# EAGLE design amplifier (EAGLE 9.6.2)
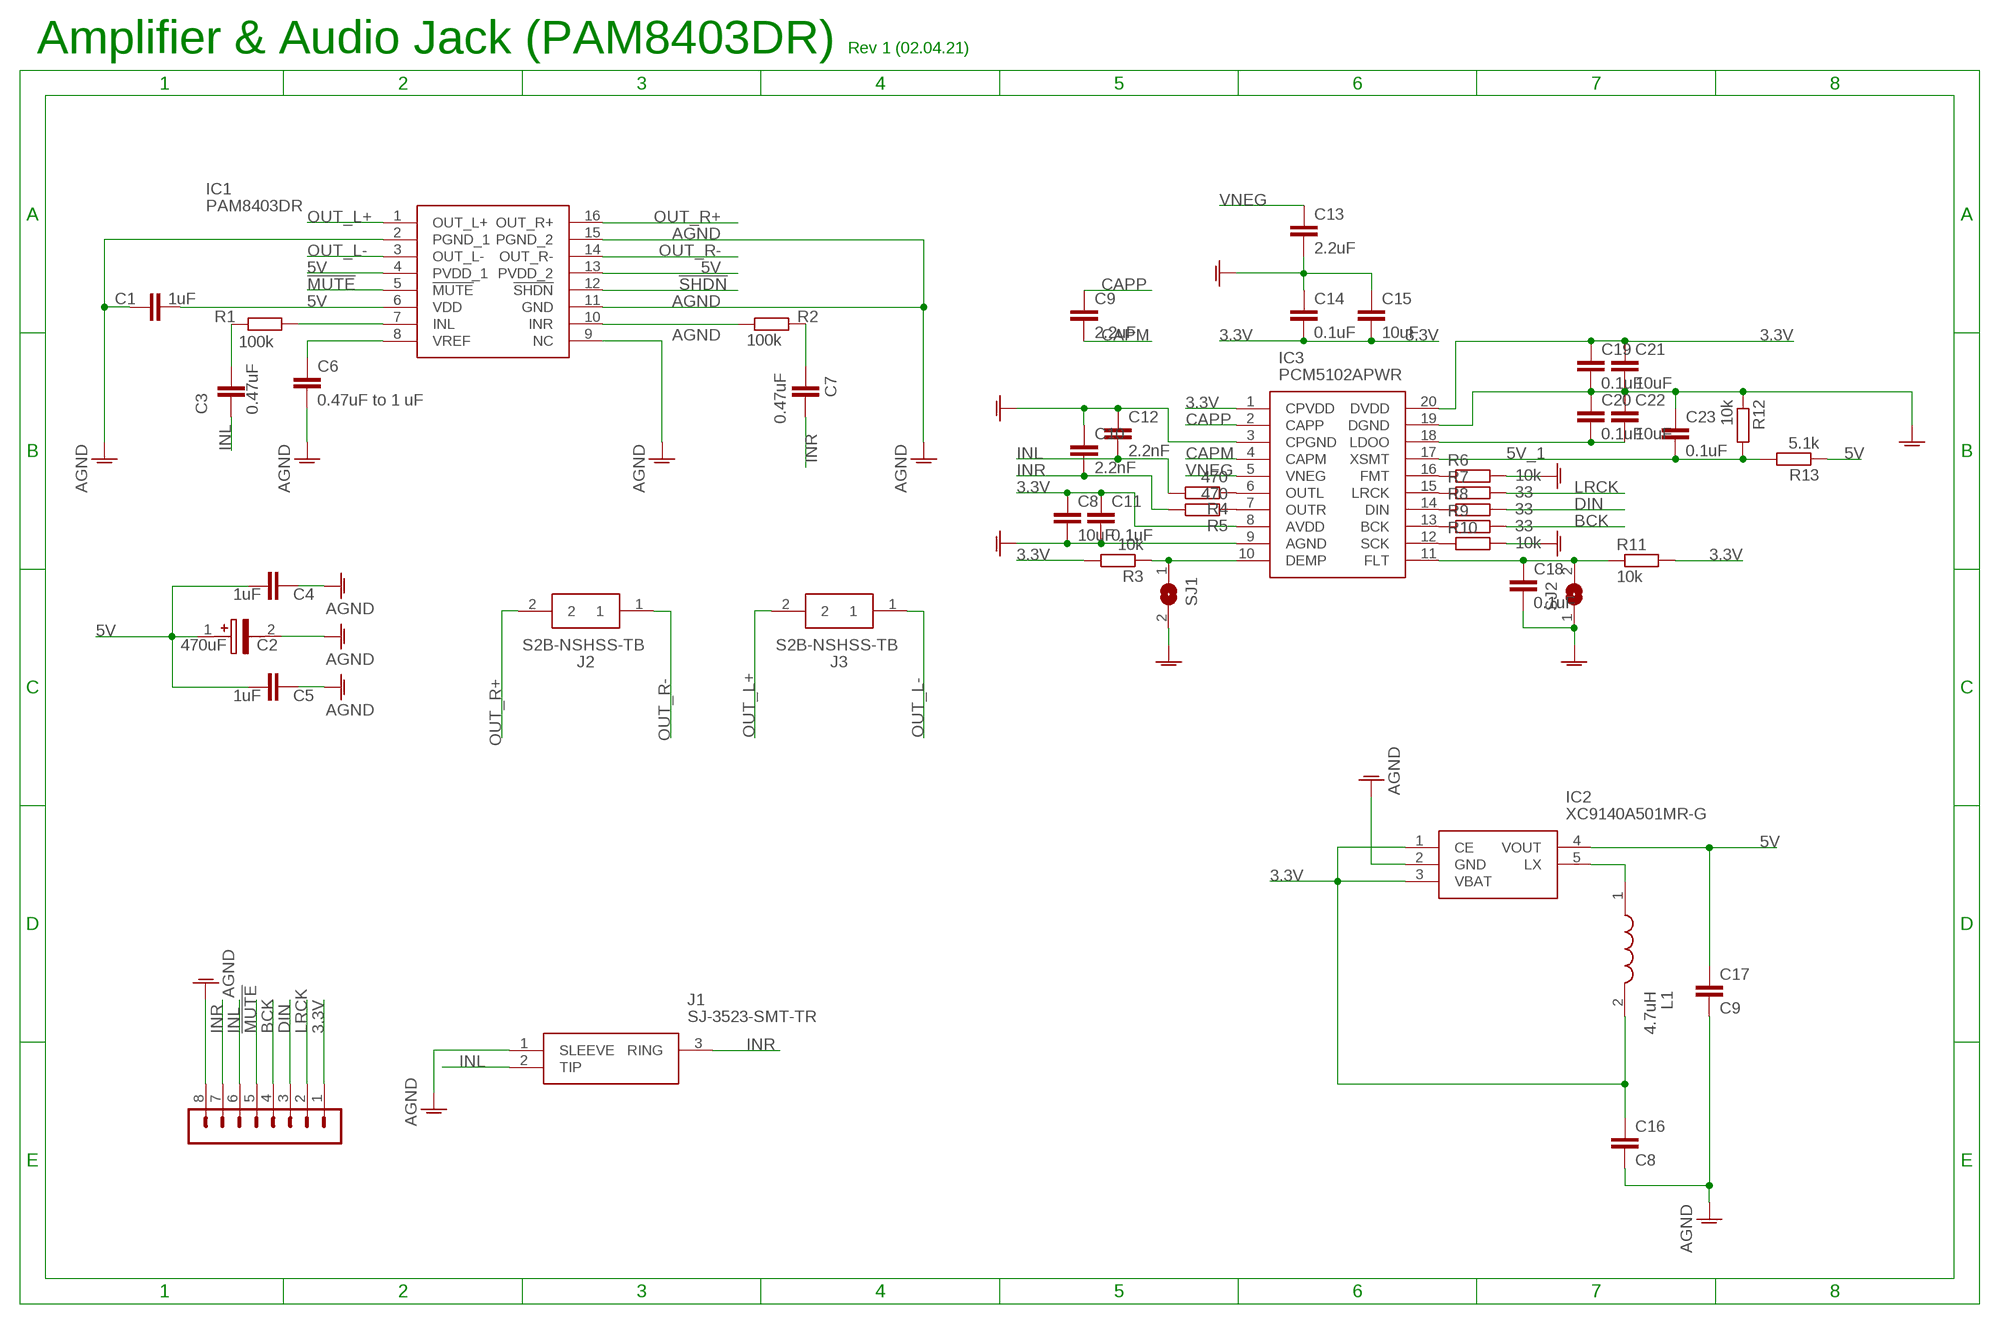
[diagram p0: schematic, sheet 1]

## Parts
C1  1uF  C-EU_805C0805  [C0805]
C2  470uF  293D477X9010E2TE3  [CAPPM7343X430N]
C3  0.47uF  C-EU_805C0805  [C0805]
C4  1uF  C-EU_805C0805  [C0805]
C5  1uF  C-EU_805C0805  [C0805]
C6  0.47uF to 1 uF  C-EU_805C0805  [C0805]
C7  0.47uF  C-EU_805C0805  [C0805]
C8  10uF  C-EUC0603  [C0603]
C9  2.2uF  C-EUC0603  [C0603]
C10  2.2nF  C-EUC0603  [C0603]
C11  0.1uF  C-EUC0603  [C0603]
C12  2.2nF  C-EUC0603  [C0603]
C13  2.2uF  C-EUC0603  [C0603]
C14  0.1uF  C-EUC0603  [C0603]
C15  10uF  C-EUC0603  [C0603]
C16  C8  C-EUC1206K  [C1206K]
C17  C9  C-EUC1206K  [C1206K]
C18  0.1uF  C-EUC0603K  [C0603K]
C19  0.1uF  C-EUC0603K  [C0603K]
C20  0.1uF  C-EUC0603K  [C0603K]
C21  10uF  C-EUC0603K  [C0603K]
C22  10uF  C-EUC0603K  [C0603K]
C23  0.1uF  C-EUC0603K  [C0603K]
IC1  PAM8403DR  [SOIC127P605X175-16N]
IC2  XC9140A501MR-G  [SOT95P280X130-5N]
IC3  PCM5102APWR  [SOP65P640X120-20N]
J1  SJ-3523-SMT-TR  [SJ3523SMTTR]
J2  S2B-NSHSS-TB  [SM02B-NSHSS-TB]
J3  S2B-NSHSS-TB  [SM02B-NSHSS-TB]
JP1  PINHEADER-1X8  [MA08-1]
L1  4.7uH  VLS6045EX-221M  [INDPM6060X450N]
R1  100k  R-EU_805R0805  [R0805]
R2  100k  R-EU_805R0805  [R0805]
R3  10k  R-EU_R0603  [R0603]
R4  470  R-EU_R0603  [R0603]
R5  470  R-EU_R0603  [R0603]
R6  10k  R-EU_R0603  [R0603]
R7  33  R-EU_R0603  [R0603]
R8  33  R-EU_R0603  [R0603]
R9  33  R-EU_R0603  [R0603]
R10  10k  R-EU_R0603  [R0603]
R11  10k  R-EU_R0603  [R0603]
R12  10k  R-EU_R0603  [R0603]
R13  5.1k  R-EU_R0603  [R0603]
SJ1  SJ  [SJ]
SJ2  SJ  [SJ]

## Nets
3.3V: C8.1 C11.1 C14.2 C15.2 C16.1 C19.1 C21.1 IC2.1(CE) IC2.3(VBAT) IC3.1(CPVDD) IC3.8(AVDD) IC3.20(DVDD) JP1.1 L1.2 R3.2 R11.2
5V: C1.1 C2.1(+) C4.1 C5.1 C17.1 IC1.4(PVDD_1) IC1.6(VDD) IC1.13(PVDD_2) IC2.4(VOUT) R13.1
5V_1: C23.2 IC3.17(XSMT) R12.2 R13.2
!MUTE: IC1.5(!MUTE) JP1.5
!SHDN: IC1.12(!SHDN)
AGND: C1.2 C2.2(-) C4.2 C5.2 C6.2 C8.2 C10.1 C11.2 C12.1 C13.2 C14.1 C15.1 C16.2 C17.2 C18.2 C19.2 C20.1 C21.2 C22.1 C23.1 IC1.2(PGND_1) IC1.9(NC) IC1.11(GND) IC1.15(PGND_2) IC2.2(GND) IC3.3(CPGND) IC3.9(AGND) IC3.19(DGND) J1.1(SLEEVE) JP1.8 R6.2 R10.2 R12.1 SJ1.2 SJ2.1
BCK: JP1.4 R9.2
CAPM: C9.2 IC3.4(CAPM)
CAPP: C9.1 IC3.2(CAPP)
DIN: JP1.3 R8.2
IC2_INL: IC1.7(INL) R1.1
IC2_INR: IC1.10(INR) R2.1
IC2_VREF: C6.1 IC1.8(VREF)
INL: C3.1 C12.2 J1.2(TIP) JP1.6 R4.2
INR: C7.2 C10.2 J1.3(RING) JP1.7 R5.2
LRCK: JP1.2 R7.2
N$1: IC2.5(LX) L1.1
N$2: IC3.12(SCK) R10.1
N$3: IC3.13(BCK) R9.1
N$4: IC3.14(DIN) R8.1
N$5: IC3.15(LRCK) R7.1
N$6: IC3.16(FMT) R6.1
N$7: IC3.7(OUTR) R5.1
N$8: IC3.6(OUTL) R4.1
N$10: C18.1 IC3.11(FLT) R11.1 SJ2.2
N$11: C3.2 R1.2
N$12: C7.1 R2.2
N$14: IC3.10(DEMP) R3.1 SJ1.1
N$15: C20.2 C22.2 IC3.18(LDOO)
OUT_L+: IC1.1(OUT_L+) J3.2
OUT_L-: IC1.3(OUT_L-) J3.1
OUT_R+: IC1.16(OUT_R+) J2.2
OUT_R-: IC1.14(OUT_R-) J2.1
VNEG: C13.1 IC3.5(VNEG)

## Notes on the sheet
- Amplifier & Audio Jack (PAM8403DR) | Rev 1 (02.04.21)

## Library data of the parts
C1 C3-C7 = CommonParts:C-EU_805: CAPACITOR, European symbol; SPICEPREFIX: C
C2 = MouserUseful:293D477X9010E2TE3: Solid Tantalum Surface Mount Chip Capacitors TANTAMOUNT(TM), Molded Case, Standard Industrial Grade Source: Datasheet <http://www.vishay.com/doc?40002>; DESCRIPTION: Solid Tantalum Surface Mount Chip Capacitors TANTAMOUNT(TM), Molded Case, Standard Industrial Grade; HEIGHT: 4.3mm; MANUFACTURER_NAME: Vishay; MANUFACTURER_PART_NUMBER: 293D477X9010E2TE3; MOUSER_PART_NUMBER: 74-293D477X9010E2TE3; MOUSER_PRICE-STOCK: https://www.mouser.co.uk/ProductDetail/Vishay-Sprague/293D477X9010E2TE3/?qs=rQrCv%2FN695FTUwC4XgLqtg%3D%3D
C8-C23 = rcl:C-EU: CAPACITOR, European symbol; SPICEPREFIX: C
IC1 = MouserUseful:PAM8403DR: Class-D Stereo Audio Amp 5V 2x3W SOP16 DiodesZetex PAM8403DR Audio Amplifier, Class-D Stereo, 16-Pin SOP Source: Datasheet <https://componentsearchengine.com/Datasheets/1/PAM8403DR.pdf>; DESCRIPTION: Class-D Stereo Audio Amp 5V 2x3W SOP16 DiodesZetex PAM8403DR Audio Amplifier, Class-D Stereo, 16-Pin SOP; HEIGHT: 1.75mm; MANUFACTURER_NAME: Diodes Inc.; MANUFACTURER_PART_NUMBER: PAM8403DR; MOUSER_PART_NUMBER: 621-PAM8403DR; MOUSER_PRICE-STOCK: https://www.mouser.com/Search/Refine.aspx?Keyword=621-PAM8403DR
IC2 = MouserUseful:XC9140A501MR-G: Switching Voltage Regulators PFM Control Snchrns StepUpDCDC Converter Source: Datasheet; DESCRIPTION: Switching Voltage Regulators PFM Control Snchrns StepUpDCDC Converter; HEIGHT: 1.3mm; MANUFACTURER_NAME: Torex; MANUFACTURER_PART_NUMBER: XC9140A501MR-G; MOUSER_PART_NUMBER: 865-XC9140A501MR-G; MOUSER_PRICE-STOCK: https://www.mouser.co.uk/ProductDetail/Torex-Semiconductor/XC9140A501MR-G/?qs=AsjdqWjXhJ8xw9tvUM0FMA%3D%3D
IC3 = MouserUseful:PCM5102APWR: 2VRMS DirectPath, 112dB Audio Stereo DAC with 32-bit, 384kHz PCM Interface Source: Datasheet <https://componentsearchengine.com/Datasheets/2/PCM5102APWR.pdf>; DESCRIPTION: 2VRMS DirectPath, 112dB Audio Stereo DAC with 32-bit, 384kHz PCM Interface; HEIGHT: 1.2mm; MANUFACTURER_NAME: Texas Instruments; MANUFACTURER_PART_NUMBER: PCM5102APWR; MOUSER_PART_NUMBER: 595-PCM5102APWR; MOUSER_PRICE-STOCK: https://www.mouser.co.uk/ProductDetail/Texas-Instruments/PCM5102APWR?qs=E2%2FxqS9xjzrfECkwEYoiyg%3D%3D
J1 = MouserUseful:SJ-3523-SMT-TR: Phone Connectors Audio Jacks Source: Datasheet <https://www.mouser.de/datasheet/2/670/sj_352x_smt-1779397.pdf>; DESCRIPTION: Phone Connectors Audio Jacks; HEIGHT: 5.2mm; MANUFACTURER_NAME: CUI Devices; MANUFACTURER_PART_NUMBER: SJ-3523-SMT-TR; MOUSER_PART_NUMBER: 490-SJ-3523-SMT-TR; MOUSER_PRICE-STOCK: https://www.mouser.co.uk/ProductDetail/CUI-Devices/SJ-3523-SMT-TR?qs=WyjlAZoYn51zOHzJ3r4ZRA%3D%3D
J2 J3 = CommonParts:S2B-NSHSS-TB: NSH 1.0mm SMT shrouded R/A PCB header,2P JST NSH Series, 1mm Pitch 2 Way 1 Row Shrouded Right Angle PCB Header, Surface Mount, Solder Termination Source: Datasheet <http://www.jst-mfg.com/product/pdf/eng/eNSH.pdf>; DESCRIPTION: NSH 1.0mm SMT shrouded R/A PCB header,2P JST NSH Series, 1mm Pitch 2 Way 1 Row Shrouded Right Angle PCB Header, Surface Mount, Solder Termination; HEIGHT: mm; MANUFACTURER_NAME: JST (JAPAN SOLDERLESS TERMINALS); MANUFACTURER_PART_NUMBER: SM02B-NSHSS-TB(LF)(SN)
JP1 = CommonParts:PINHEADER-1X8: PIN HEADER; OC_FARNELL: unknown; OC_NEWARK: unknown
L1 = MouserUseful:VLS6045EX-221M: Wirewound Inductor 220uH 500mA 1.15 mOhm TDK VLS-EX Series Shielded Wire-wound SMD Inductor with a Ferrite Core, 220 uH Wire-Wound 500mA Idc Source: Datasheet <https://product.tdk.com/info/en/catalog/datasheets/inductor_commercial_power_vls6045ex_en.pdf>; DESCRIPTION: Wirewound Inductor 220uH 500mA 1.15 mOhm TDK VLS-EX Series Shielded Wire-wound SMD Inductor with a Ferrite Core, 220 uH Wire-Wound 500mA Idc; HEIGHT: 4.5mm; MANUFACTURER_NAME: TDK; MANUFACTURER_PART_NUMBER: VLS6045EX-221M; MOUSER_PART_NUMBER: 810-VLS6045EX-221M; MOUSER_PRICE-STOCK: https://www.mouser.com/Search/Refine.aspx?Keyword=810-VLS6045EX-221M; RS_PART_NUMBER: 1247062; RS_PRICE-STOCK: http://uk.rs-online.com/web/p/products/1247062
R1 R2 = CommonParts:R-EU_805: RESISTOR, European symbol
R3-R13 = rcl:R-EU_: RESISTOR, European symbol; SPICEPREFIX: R
SJ1 SJ2 = jumper:SJ: SMD solder JUMPER

## Net classes
0 default: width 0.152 mm, drill 0.2 mm, clearance 0.2 mm
1 other: width 0.152 mm, drill 0.2 mm, clearance 0.205 mm to class 0, clearance 0.205 mm

## Board
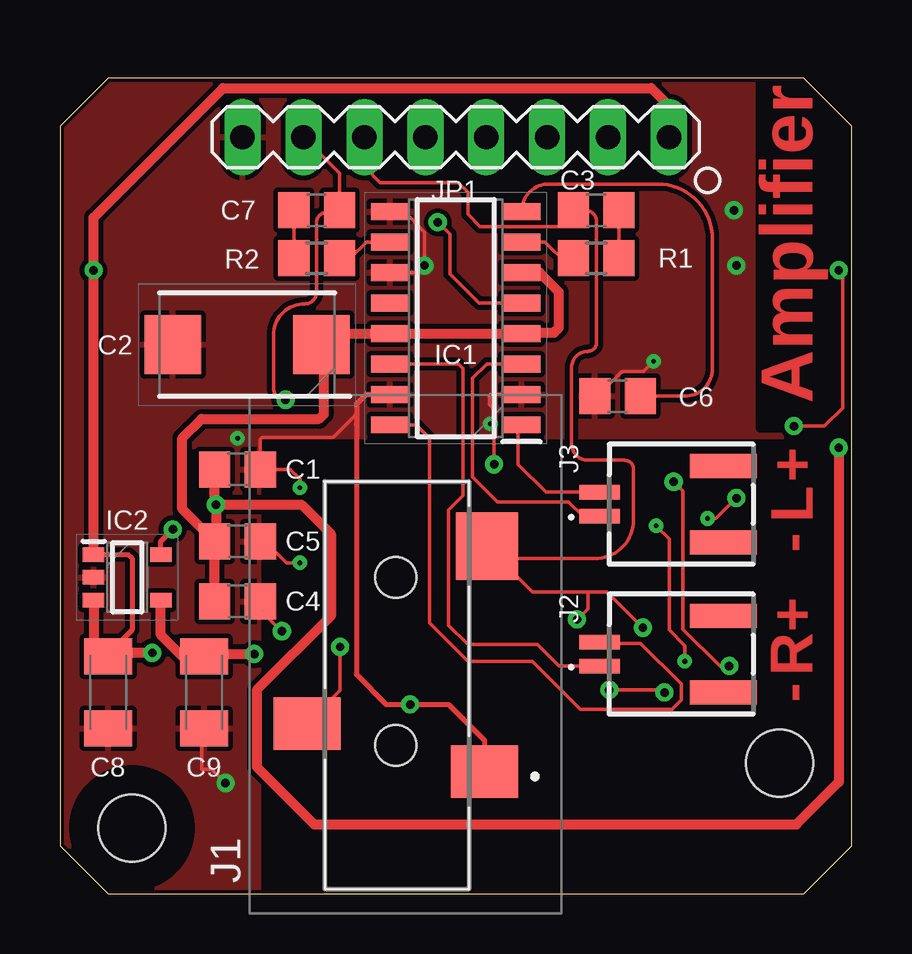
[diagram p1: board, top side]
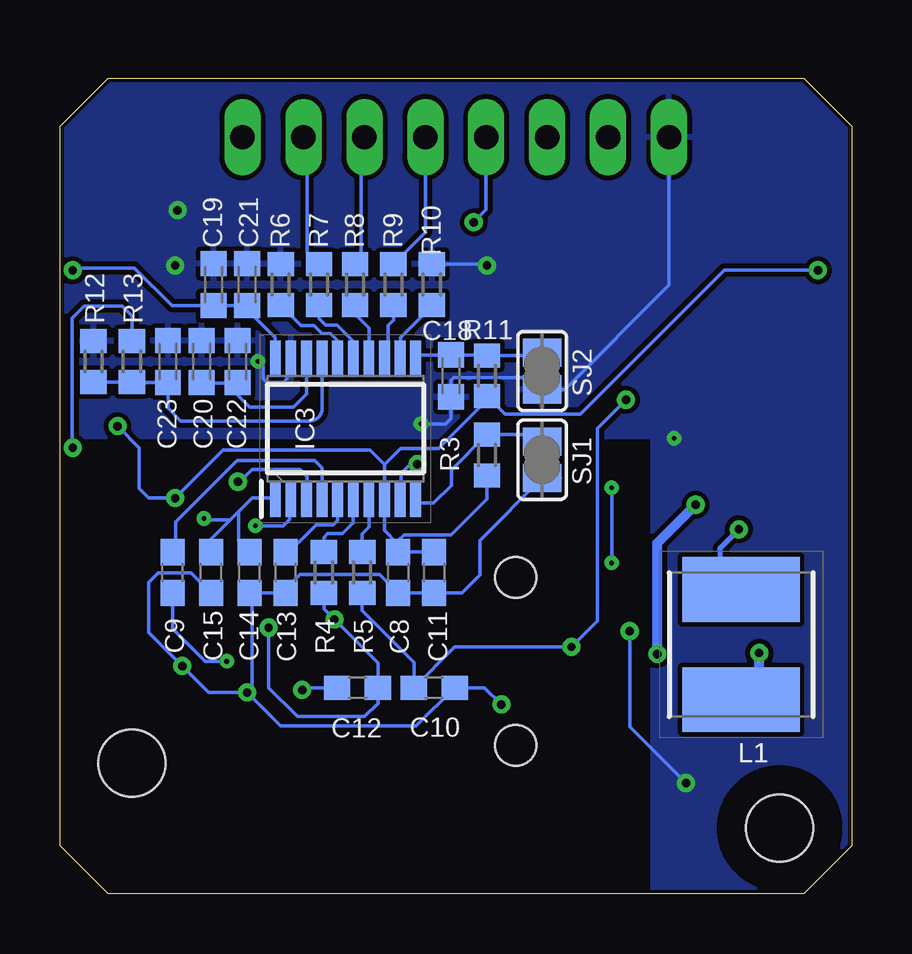
[diagram p2: board, bottom side, seen from below]

Size 33 x 34 mm. Coordinates in mm from the lower left corner, seen from the top.
Outline: 33,2 33,32 31,34 2,34 0,32 0,2 2,0 31,0 33,2
Copper layers (1*16): Top 0.035mm / dielectric 1.5mm / Bottom 0.035mm
Design rules "CNC *": minimum track width 6mil, minimum drill 0.2mm, track to track 0.2mm, track to pad 0.2mm, pad to pad 0.2mm, via to via 0.2mm, smd to smd 0.2mm, copper to edge 6mil, drill to drill 6mil, minimum pad ring 10mil, minimum via ring 8mil, stop-mask expansion 0.1mm, vias tented up to drill 0.1mm, thermal gap 0.2mm
Holes 2.8 mm at 3,2.75 30,5.45
tRestrict: area 1.7,1.4 to 4.3,4.1
bRestrict: area 1.7,1.4 to 4.3,4.1

### Footprints (pad centres in the part's own frame; a part is rotated, then mirrored left to right if it is on the bottom)
C0805 = smd 1.3 x 1.5: 1 -0.95,0; 2 0.95,0
CAPPM7343X430N = smd 2.35 x 2.45: 1 -3.1,0; 2 3.1,0
C0603 = smd 1.1 x 1: 1 -0.85,0; 2 0.85,0
C1206K = smd 1.5 x 2: 1 -1.5,0; 2 1.5,0
C0603K = smd 1.05 x 1.08: 1 -0.875,0; 2 0.875,0
SOIC127P605X175-16N = smd 1.575 x 0.7: 1 -2.738,4.445; 2 -2.738,3.175; 3 -2.738,1.905; 4 -2.738,0.635; 5 -2.738,-0.635; 6 -2.738,-1.905; 7 -2.738,-3.175; 8 -2.738,-4.445; 9 2.738,-4.445; 10 2.738,-3.175; 11 2.738,-1.905; 12 2.738,-0.635; 13 2.738,0.635; 14 2.738,1.905; 15 2.738,3.175; 16 2.738,4.445
SOT95P280X130-5N = smd 0.9 x 0.6: 1 -1.4,0.95; 2 -1.4,0; 3 -1.4,-0.95; 4 1.4,-0.95; 5 1.4,0.95
SOP65P640X120-20N = smd 1.475 x 0.45: 1 -2.938,2.925; 2 -2.938,2.275; 3 -2.938,1.625; 4 -2.938,0.975; 5 -2.938,0.325; 6 -2.938,-0.325; 7 -2.938,-0.975; 8 -2.938,-1.625; 9 -2.938,-2.275; 10 -2.938,-2.925; 11 2.938,-2.925; 12 2.938,-2.275; 13 2.938,-1.625; 14 2.938,-0.975; 15 2.938,-0.325; 16 2.938,0.325; 17 2.938,0.975; 18 2.938,1.625; 19 2.938,2.275; 20 2.938,2.925
SJ3523SMTTR = smd 2.2 x 2.8: 1 2.4,-3.7; 3 4.4,3.7 | smd 2.8 x 2.6: 2 11.8,-3.8 | hole 1.7: 3.5,0; 10.5,0
SM02B-NSHSS-TB = smd 0.6 x 1.7: 1 1,0; 2 0,0 | smd 1 x 2.8: 3 -1.1,5.15; 4 2.1,5.15
MA08-1 = drill 1.016 long: 1 -8.89,0; 2 -6.35,0; 3 -3.81,0; 4 -1.27,0; 5 1.27,0; 6 3.81,0; 7 6.35,0; 8 8.89,0
INDPM6060X450N = smd 2.7 x 4.9: 1 -2.3,0; 2 2.3,0
R0805 = smd 1.3 x 1.5: 1 -0.95,0; 2 0.95,0
R0603 = smd 1 x 1.1: 1 -0.85,0; 2 0.85,0
SJ = smd 1.168 x 1.6: 1 -0.762,0; 2 0.762,0

### Placement (x,y rotation side)
C1  7.4,17.7 0 top
C2  7.8,22.9 180 top
C3  22.35,28.5 0 top
C4  7.4,12.2 0 top
C5  7.4,14.7 0 top
C6  23.25,20.75 180 top
C7  10.7,28.5 0 top
C8  18.9,13.4 270 bottom
C9  28.3,13.4 90 bottom
C10  17.4,8.6 180 bottom
C11  17.4,13.4 270 bottom
C12  20.6,8.6 0 bottom
C13  23.6,13.4 270 bottom
C14  25.1,13.4 90 bottom
C15  26.7,13.4 90 bottom
C16  2,8.4 270 top
C17  6,8.4 270 top
C18  16.7,21.6 270 bottom
C19  26.6,25.4 90 bottom
C20  27.1,22.2 270 bottom
C21  25.2,25.4 90 bottom
C22  25.6,22.2 270 bottom
C23  28.5,22.2 270 bottom
IC1  16.5,24 180 top
IC2  2.8,13.2 0 top
IC3  21.1,19.4 90 bottom
J1  14,2.7 90 top
J2  22.5,10.5 270 top
J3  22.5,16.75 270 top
JP1  16.5,31.55 180 top
L1  4.6,10.4 270 bottom
R1  22.35,26.5 0 top
R2  10.7,26.5 180 top
R3  15.2,18.3 270 bottom
R4  22,13.4 270 bottom
R5  20.4,13.4 270 bottom
R6  23.8,25.4 90 bottom
R7  22.2,25.4 90 bottom
R8  20.7,25.4 90 bottom
R9  19.1,25.4 90 bottom
R10  17.5,25.4 90 bottom
R11  15.2,21.6 270 bottom
R12  31.6,22.2 270 bottom
R13  30,22.2 270 bottom
SJ1  12.9,18.1 270 bottom
SJ2  12.9,21.8 90 bottom

### Tracks (layer width: path | path; a pad name or v marks a point on that pad's centre or on a via)
3.3V  (via drill 0.2 pad 0.3, 0.35)
  Top 0.152: v30.6,19.5 31.86,19.5 32.63,20.27 32.63,25.84 v32.47,26 | v27,15.65 27.35,15.65 v28.2,16.5
  Top 0.2: IC2.1 2.85,14.15 3,14 3,11 1.95,9.95
  Top 0.406: IC2.3 1.4,10.5 1.95,9.95 C16.1 2.15,10.05 v3.85,10.05 | IC2.1 v1.4,26 1.4,28.2 6.8,33.6 24.65,33.6 25.39,32.86 JP1.1
  Bottom 0.152: 18.9,14.57 18.9,14.73 18.66,14.97 16.69,14.97 15.2,16.46 R3.2 | 18.9,14.57 C8.1 C11.1 | 18.9,14.57 19.48,15.14 IC3.8 19.48,17.89 | 19.48,17.89 18.8,18.57 17.22,18.57 15.2,20.59 R11.2 14.45,20 11.3,20 5.3,26 v1.4,26 | IC3.20 24.02,23.2 25.2,24.37 C21.1 C19.1 28.32,24.52 29.9,26.1 32.4,26.1 32.47,26.03 v32.47,26 | IC3.1 24.06,16.5 25,16.5 25.55,15.95 | C15.2 26.7,14.8 25.9,15.6 | 25.9,15.6 25.55,15.95 | 19.48,17.89 20.08,18.5 26.2,18.5 v28.2,16.5 29.3,16.5 29.7,16.9 29.7,18.6 v30.6,19.5 | C14.2 25.55,14.7 25.55,15.95 | 25.9,15.6 26.95,15.6 v27,15.65
  Bottom 0.406: L1.2 3.85,8.85 v3.85,10.05
5V  (via drill 0.35)
  Top 0.406: IC2.4 4.2,10.8 5.1,9.9 C17.1 6.1,10 v8.1,10 | v6.5,16.23 6.45,16.28 C1.1 | 6.4,12.25 C4.1 C5.1 | 11,23 C2.1 11.37,23.36 IC1.13 IC1.4 19.27,23.4 20.6,23.4 20.8,23.6 20.8,25.1 20,25.91 IC1.6 | 11.06,23.36 11,23.3 11,23 | 11,23 11,20 10.8,19.8 5.9,19.8 5.1,19 5.1,16.05 C5.1 | v6.5,16.23 10.07,16.23 11.3,15 11.3,11.6 8.2,8.5 8.2,5.3 10.6,2.9 30.7,2.9 32.47,4.67 v32.47,18.6 | v6.5,16.23 6.5,14.75 C5.1
  Bottom 0.152: R13.1 30,24.1 30.4,24.5 32,24.5 32.5,24 32.5,18.63 v32.47,18.6
  Bottom 0.406: v8.1,10 8.1,14.63 v6.5,16.23
5V_1
  Bottom 0.152: IC3.17 22.07,20.24 arc90 22.59,19.72 27.97,19.72 28.5,20.25 C23.2 29.98,21.32 R13.2 R12.2
!MUTE  (via drill 0.35)
  Top 0.152: IC1.5 17.46,24.64 16.25,25.85 16.25,27.5 v15.75,28
  Bottom 0.152: JP1.5 15.23,28.52 v15.75,28
AGND  (via drill 0.2 pad 0.3, 0.35)
  Top 0.152: IC1.15 12.9,20.82 | 12.36,20 11.38,19.02 8.42,19.02 8.35,18.95 C1.2 9.6,17.7 10,17.3 v10,16.93 | v22.9,8.5 25.1,8.5 v25.2,8.4 | v18.1,17.92 18.1,19.6 | 18.1,19.6 18.1,20.2 17.9,20.4 17.9,20.8 17.93,20.82 IC1.2 | v25.58,17.18 25.97,16.79 25.97,11.04 27.51,9.5 v27.9,9.5 | IC1.9 14.36,28.45 15.2,27.6 v15.2,26.2 15.2,26 15.1,25.9 IC1.11 | v24.75,22.2 24.32,21.78 23.44,21.78 22.41,20.75 C6.2 | v10,13.8 9.45,13.8 8.55,14.7 C5.2 | v17.95,19.6 18.1,19.6 | 8.45,12.1 C4.2 8.35,11.85 v9.25,10.95 | v6.9,4.62 6.32,5.2 5.9,5.2 5.9,6.8 C17.2
  Top 0.2: 12.9,20.82 12.76,20.82 12.36,20.43 12.36,20 12.36,19.59 12.35,19.59 12.35,9.15 13.6,7.9 v14.6,7.9 16.2,7.9 17.7,6.4 J1.1
  Bottom 0.152: v25.2,8.4 23.8,7 18.15,7 C10.1 15.3,8.6 v14.6,7.9 | v25.2,8.4 25,8.6 25,12.45 C14.1 C13.2 23.6,12.72 23,13.33 19.68,13.33 C8.2 C11.2 16.25,12.55 15.5,13.3 15.5,14.74 SJ1.2 12.14,17.34 | C15.1 27.53,13.38 28.91,13.38 29.3,12.99 29.3,10.9 v27.9,9.5 26.8,8.4 v25.2,8.4 | C12.1 22.8,8.6 v22.9,8.5 | IC3.9 18.78,16.51 18.78,17.52 18.38,17.92 v18.1,17.92 | 22.87,16.31 IC3.3 22.7,16.49 22.7,17.4 23,17.7 25,17.7 25.52,17.18 v25.58,17.18 | R10.2 15.25,26.25 v15.2,26.2 | v24.75,22.2 24.53,21.98 24.53,21.49 24.36,21.32 23.69,21.32 23.52,21.49 23.52,22.19 IC3.19 | v10,16.93 v10,13.8 | 13.4,21.24 13.2,21.04 SJ2.1 11.95,21.04 7.61,25.38 JP1.8 | v17.95,19.6 16.93,19.6 16.7,19.82 C18.2 16.7,21.4 16.57,21.53 13.39,21.53 | v9.25,10.95 9.25,6.97 v6.9,4.62
  other vias: 7.4,19 28.1,28.5 28.2,26.2
  pour Top: -0.1,0 -0.1,31.9 2.25,34.25 30.75,34.25 33,32 33,0
  pour Bottom: -0.1,0 -0.1,31.9 2.25,34.25 30.75,34.25 33,32 33,0
  cutout Top (isolate 0.305): 8.4,18.95 33,18.95 33,0 8.4,0
  cutout Bottom (isolate 0.305): 8.4,18.95 33,18.95 33,0 8.4,0
BCK
  Bottom 0.152: JP1.4 17.77,27.58 R9.2
CAPM
  Bottom 0.152: C9.2 28.18,14.37 28.18,15.51 25.61,18.08 22.39,18.08 22.07,17.77 IC3.4
CAPP  (via drill 0.2 pad 0.3)
  Top 0.152: v24.85,15.35 25.4,14.8 25.4,11 26.05,10.35 v26.05,9.7
  Bottom 0.152: IC3.2 23.42,16.42 23.42,15.62 23.69,15.35 v24.85,15.35 | C9.1 28.3,11.05 26.95,9.7 v26.05,9.7
DIN
  Bottom 0.152: R8.2 20.45,26.5 20.45,31.41 JP1.3
IC2_INL
  Top 0.152: R1.1 21.15,26.25 | 21.15,26.25 20.93,26.02 | IC1.7 20.23,27.18 21.15,26.25
IC2_INR
  Top 0.152: R2.1 12.1,26.5 12.78,27.18 IC1.10
IC2_VREF
  Top 0.152: C6.1 26.06,20.75 arc90 27.2,21.89 27.2,27.3 arc90 24.91,29.6 20.39,29.6 arc90 IC1.8
INL  (via drill 0.35)
  Top 0.152: 18.32,13.98 22.3,13.98 arc90 23.91,15.59 23.91,17.71 arc90 23.54,18.08 22.02,18.08 arc-90 21.33,18.77 21.33,21.95 arc-90 22,22.62 arc90 22.37,22.99 22.37,28.03 arc90 21.9,28.5 C3.1 | 18.32,13.98 J1.2 | C3.1 | C3.1 arc-90 20.72,27.81 17.52,27.81 17,28.33 17,29.25 16.6,29.65 13.35,29.65 12.75,30.25 12.75,31.49 JP1.6 | v24.3,11.1 22.8,12.6 22,12.6 | 22,12.6 19.7,12.6 18.32,13.98 | v21.55,11.45 22,11.89 22,12.6
  Bottom 0.152: R4.2 22,11.89 v21.55,11.45 19.75,9.64 C12.2 19.75,7.95 20.3,7.4 23.1,7.4 24.3,8.6 v24.3,11.1
INR  (via drill 0.35)
  Top 0.152: 10.28,7.12 J1.3 11.68,8.48 v11.68,10.3 | v9.4,20.6 arc-90 8.9,21.1 8.9,23.3 arc-90 10.2,24.6 arc90 10.7,25.1 10.7,28 arc-90 11.1,28.4 11.55,28.4 arc90 C7.2 11.65,30.05 JP1.7
  Bottom 0.152: R5.2 20.4,11.81 18.25,9.66 C10.2 16.55,10.3 v11.68,10.3 10.6,11.38 10.6,19.4 v9.4,20.6
LRCK
  Bottom 0.152: R7.2 22.7,26.75 22.7,31.4 JP1.2
N$1  (via drill 0.35)
  Top 0.2: IC2.5 4.2,14.7 v4.7,15.2
  Bottom 0.2: v4.7,15.2 5.5,14.4 5.5,12.5 4.8,12.5 L1.1
N$2
  Bottom 0.152: IC3.12 18.8,22.36 18.8,23.2 17.5,24.5 R10.1
N$3
  Bottom 0.152: IC3.13 19.33,22.49 19.33,23.69 19.1,23.92 R9.1
N$4
  Bottom 0.152: IC3.14 20.12,23.59 20.7,24.17 R8.1
N$5
  Bottom 0.152: IC3.15 20.77,23.04 21.45,23.72 21.93,23.72 22.2,23.99 R7.1
N$6
  Bottom 0.152: IC3.16 21.43,23.07 21.72,23.37 22.08,23.37 22.4,23.69 22.94,23.69 R6.1
N$7
  Bottom 0.152: IC3.7 20.11,15.3 20.4,15.01 R5.1
N$8
  Bottom 0.152: IC3.6 20.77,15.46 21.22,15.02 21.84,15.02 22,14.86 R4.1
N$10
  Bottom 0.152: IC3.11 18.04,22.48 C18.1 15.22,22.48 R11.1 13.01,22.45 SJ2.2
N$11
  Top 0.152: C3.2 R1.2
N$12
  Top 0.152: C7.1 R2.2
N$14
  Bottom 0.152: IC3.10 18,16.29 17.42,16.29 16.68,17.03 16.68,17.68 R3.1 13.19,19.15 SJ1.1
N$15
  Bottom 0.152: IC3.18 22.73,20.84 23.26,20.3 25.1,20.3 25.6,20.8 25.6,21.3 | 25.6,21.3 C22.2 | C20.2 27.07,21.3 25.6,21.3
OUT_L+
  Top 0.152: J3.2 20.25,16.75 19.1,17.9 19.1,19.42 IC1.1
OUT_L-
  Top 0.152: J3.1 21.8,15.75 21.2,16.35 18.24,16.35 17.2,17.39 17.2,21.5 17.8,22.09 IC1.3
OUT_R+
  Top 0.152: IC1.16 arc-90 IC1.16 14.85,19.55 15.4,19.01 15.4,11.3 17.01,9.7 19.7,9.7 21.7,7.7 25.5,7.7 25.9,8.1 25.9,8.75 24.2,10.45 22.55,10.45 J2.2 22.34,10.66
OUT_R-
  Top 0.152: J2.1 20.8,9.5 19.9,10.4 17,10.4 16.2,11.2 16.2,16 16.8,16.6 16.8,21.9 16.61,22.09 IC1.14
VNEG
  Bottom 0.152: IC3.5 21.43,15.57 21.62,15.37 22.32,15.37 23.44,14.25 C13.1

### Text on the board
Top: Amplifier | + | L | - | + | R | -
tStop: Amplifier | + | L | - | + | R | -